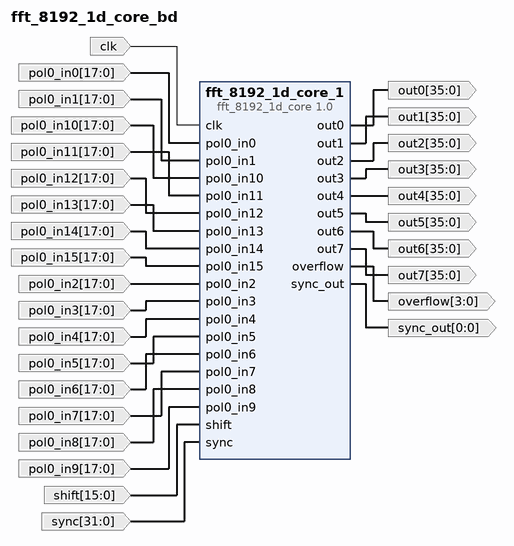
[diagram p0: block diagram of the top level]
# Vivado block design fft_8192_1d_core_bd, xc7k160tffg676-2, Vivado 2019.1.1
create_bd_design fft_8192_1d_core_bd

create_bd_port -dir I -type clk clk
create_bd_port -dir O -from 35 -to 0 -type data out0
create_bd_port -dir O -from 35 -to 0 -type data out1
create_bd_port -dir O -from 35 -to 0 -type data out2
create_bd_port -dir O -from 35 -to 0 -type data out3
create_bd_port -dir O -from 35 -to 0 -type data out4
create_bd_port -dir O -from 35 -to 0 -type data out5
create_bd_port -dir O -from 35 -to 0 -type data out6
create_bd_port -dir O -from 35 -to 0 -type data out7
create_bd_port -dir O -from 3 -to 0 -type data overflow
create_bd_port -dir I -from 17 -to 0 -type data pol0_in0
create_bd_port -dir I -from 17 -to 0 -type data pol0_in1
create_bd_port -dir I -from 17 -to 0 -type data pol0_in10
create_bd_port -dir I -from 17 -to 0 -type data pol0_in11
create_bd_port -dir I -from 17 -to 0 -type data pol0_in12
create_bd_port -dir I -from 17 -to 0 -type data pol0_in13
create_bd_port -dir I -from 17 -to 0 -type data pol0_in14
create_bd_port -dir I -from 17 -to 0 -type data pol0_in15
create_bd_port -dir I -from 17 -to 0 -type data pol0_in2
create_bd_port -dir I -from 17 -to 0 -type data pol0_in3
create_bd_port -dir I -from 17 -to 0 -type data pol0_in4
create_bd_port -dir I -from 17 -to 0 -type data pol0_in5
create_bd_port -dir I -from 17 -to 0 -type data pol0_in6
create_bd_port -dir I -from 17 -to 0 -type data pol0_in7
create_bd_port -dir I -from 17 -to 0 -type data pol0_in8
create_bd_port -dir I -from 17 -to 0 -type data pol0_in9
create_bd_port -dir I -from 15 -to 0 -type data shift
create_bd_port -dir I -from 31 -to 0 -type data sync
create_bd_port -dir O -from 0 -to 0 -type data sync_out

create_bd_cell -type ip -vlnv User_Company:SysGen:fft_8192_1d_core:1.0 fft_8192_1d_core_1

# ---- connections ----

connect_bd_net [get_bd_ports clk] [get_bd_pins fft_8192_1d_core_1/clk]
connect_bd_net [get_bd_pins fft_8192_1d_core_1/out0] [get_bd_ports out0]
connect_bd_net [get_bd_pins fft_8192_1d_core_1/out1] [get_bd_ports out1]
connect_bd_net [get_bd_pins fft_8192_1d_core_1/out2] [get_bd_ports out2]
connect_bd_net [get_bd_pins fft_8192_1d_core_1/out3] [get_bd_ports out3]
connect_bd_net [get_bd_pins fft_8192_1d_core_1/out4] [get_bd_ports out4]
connect_bd_net [get_bd_pins fft_8192_1d_core_1/out5] [get_bd_ports out5]
connect_bd_net [get_bd_pins fft_8192_1d_core_1/out6] [get_bd_ports out6]
connect_bd_net [get_bd_pins fft_8192_1d_core_1/out7] [get_bd_ports out7]
connect_bd_net [get_bd_pins fft_8192_1d_core_1/overflow] [get_bd_ports overflow]
connect_bd_net -net pol0_in0_1 [get_bd_ports pol0_in0] [get_bd_pins fft_8192_1d_core_1/pol0_in0]
connect_bd_net -net pol0_in1_1 [get_bd_ports pol0_in1] [get_bd_pins fft_8192_1d_core_1/pol0_in1]
connect_bd_net -net pol0_in10_1 [get_bd_ports pol0_in10] [get_bd_pins fft_8192_1d_core_1/pol0_in10]
connect_bd_net -net pol0_in11_1 [get_bd_ports pol0_in11] [get_bd_pins fft_8192_1d_core_1/pol0_in11]
connect_bd_net -net pol0_in12_1 [get_bd_ports pol0_in12] [get_bd_pins fft_8192_1d_core_1/pol0_in12]
connect_bd_net -net pol0_in13_1 [get_bd_ports pol0_in13] [get_bd_pins fft_8192_1d_core_1/pol0_in13]
connect_bd_net -net pol0_in14_1 [get_bd_ports pol0_in14] [get_bd_pins fft_8192_1d_core_1/pol0_in14]
connect_bd_net -net pol0_in15_1 [get_bd_ports pol0_in15] [get_bd_pins fft_8192_1d_core_1/pol0_in15]
connect_bd_net -net pol0_in2_1 [get_bd_ports pol0_in2] [get_bd_pins fft_8192_1d_core_1/pol0_in2]
connect_bd_net -net pol0_in3_1 [get_bd_ports pol0_in3] [get_bd_pins fft_8192_1d_core_1/pol0_in3]
connect_bd_net -net pol0_in4_1 [get_bd_ports pol0_in4] [get_bd_pins fft_8192_1d_core_1/pol0_in4]
connect_bd_net -net pol0_in5_1 [get_bd_ports pol0_in5] [get_bd_pins fft_8192_1d_core_1/pol0_in5]
connect_bd_net -net pol0_in6_1 [get_bd_ports pol0_in6] [get_bd_pins fft_8192_1d_core_1/pol0_in6]
connect_bd_net -net pol0_in7_1 [get_bd_ports pol0_in7] [get_bd_pins fft_8192_1d_core_1/pol0_in7]
connect_bd_net -net pol0_in8_1 [get_bd_ports pol0_in8] [get_bd_pins fft_8192_1d_core_1/pol0_in8]
connect_bd_net -net pol0_in9_1 [get_bd_ports pol0_in9] [get_bd_pins fft_8192_1d_core_1/pol0_in9]
connect_bd_net [get_bd_ports shift] [get_bd_pins fft_8192_1d_core_1/shift]
connect_bd_net [get_bd_ports sync] [get_bd_pins fft_8192_1d_core_1/sync]
connect_bd_net [get_bd_pins fft_8192_1d_core_1/sync_out] [get_bd_ports sync_out]

validate_bd_design
save_bd_design
